# EAGLE schematic BP_Korevishe (EAGLE 7.0.0)
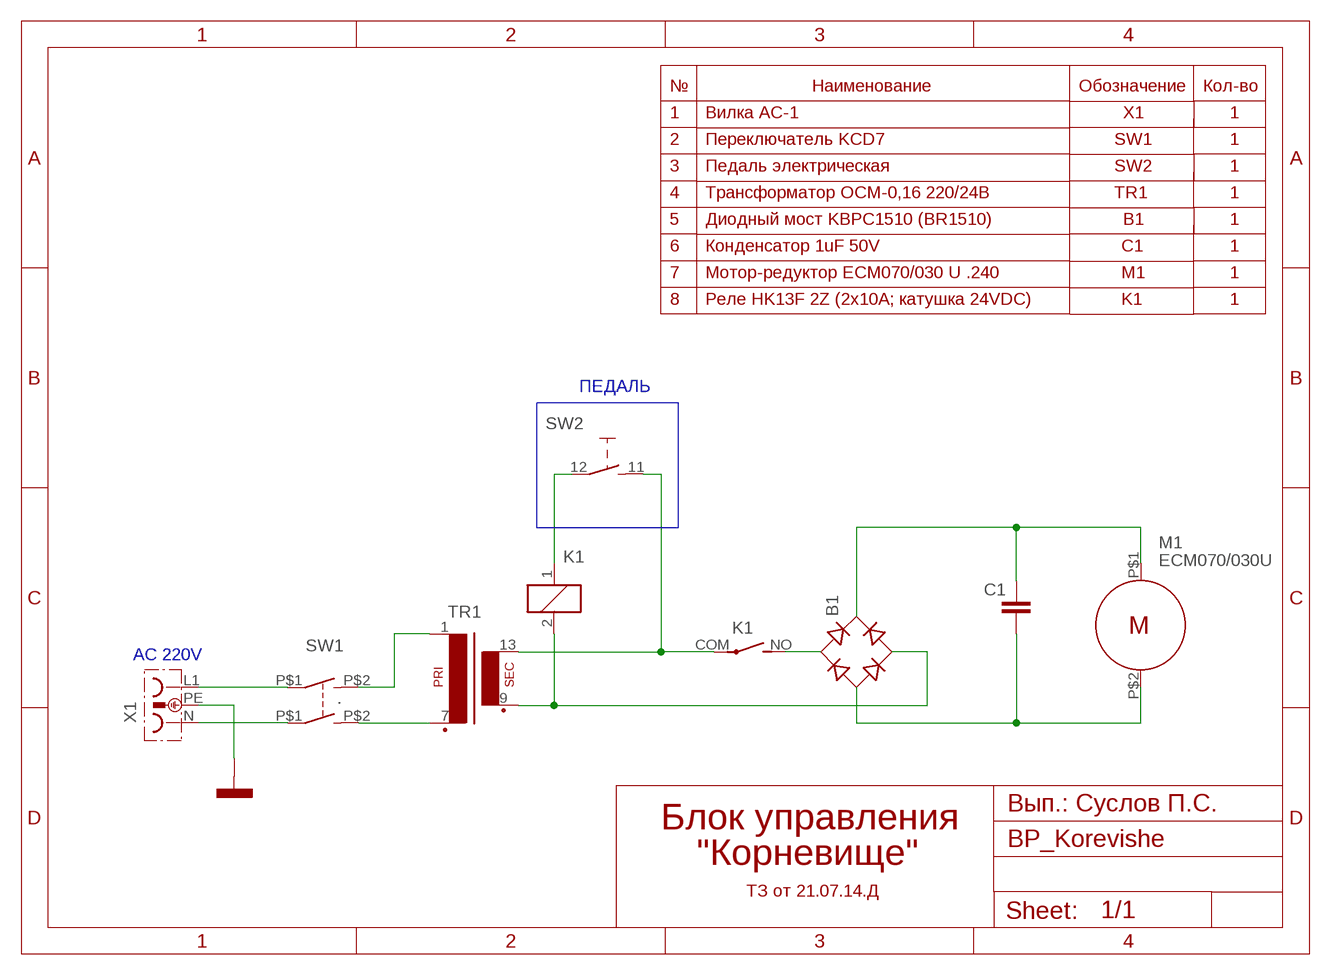
[diagram p0: schematic, sheet 1]

## Parts
.  SCHLIESSER_ARBEITSKONTAKT  [1]
B1  B-DIL  [B-DIL]
C1  C-EU325-137X374  [C325-137X374]
K1  APF30212A  [APF30212A]
M1  ECM070/030U  MOTOR  [1]
SW1  SCHLIESSER_ARBEITSKONTAKT  [1]
SW2  SCHALTER_SCHLIESSER_HANDBETAETIGT  [KIPPSCHALTER_AUS]
TR1  BV054-5381.0K  [EI54-18,8_16VA]
X1  STECKDOSE  [STECKDOSE]
X2  MASSE_ALLGEMEIN  [MASSE_ALLGEMEIN]

## Nets
N$1: X1.PE X2.1(0V)
N$2: ..P$1 X1.N
N$3: SW1.P$1 X1.L1
N$4: ..P$2 TR1.7(P2)
N$5: B1.AC1 K1.NO(2:S)
N$6: SW1.P$2 TR1.1
N$8: B1.AC2 K1.2 TR1.9(S3)
N$9: B1.- C1.2 M1.P$2
N$10: B1.+ C1.1 M1.P$1
N$11: K1.1 SW2.12(S1)
N$12: K1.COM(2:P) SW2.11(CS1) TR1.13(S4)

## Buses
B$1

## Notes on the sheet
- № | Наименование | Обозначение | Кол-во
- 1 | Вилка AC-1 | X1 | 1
- 2 | Переключатель KCD7 | SW1 | 1
- 3 | Педаль электрическая | SW2 | 1
- 4 | Трансформатор ОСМ-0,16 220/24В | TR1 | 1
- 5 | Диодный мост KBPC1510 (BR1510) | B1 | 1
- 6 | Конденсатор 1uF 50V | C1 | 1
- 7 | Мотор-редуктор ECM070/030 U .240 | M1 | 1
- 8 | Реле HK13F 2Z (2х10A; катушка 24VDC) | K1 | 1
- ПЕДАЛЬ
- AC 220V
- Вып.: Суслов П.С.
- Блок управления
- "Корневище"
- ТЗ от 21.07.14.Д

## Library data of the parts
. SW1 = e-symbole:SCHLIESSER_ARBEITSKONTAKT: Schließer (Arbeitskontakt)
B1 = rectifier:B-DIL: RECTIFIER
C1 = rcl:C-EU: CAPACITOR, European symbol
K1 = relay:APF30212A: Compliant with European standards 1a/1c 6A Slim power relays Source: Data sheet <http://pewa.panasonic.com/assets/pcsd/catalog/pf-catalog.pdf>; OC_FARNELL: unknown
M1 = e-symbole:MOTOR: Motor allgemein
SW2 = e-schalter:SCHALTER_SCHLIESSER_HANDBETAETIGT: Schließer
TR1 = trafo:BV054*: ERA EI 54/18,8 16 VA Distributor: RS-Component RS 207-5523 230V / 9V RS 207-9727 230V - 12V RS 207-5551 230V - 15V RS 207-5539 230V - 18V RS 207-5567 230V - 24V Source: 207-5567.pdf
X1 = e-steckverbinder:STECKDOSE: Steckdose mit Schutzleiter
X2 = e-klemmen:MASSE_ALLGEMEIN: Masse allgemein